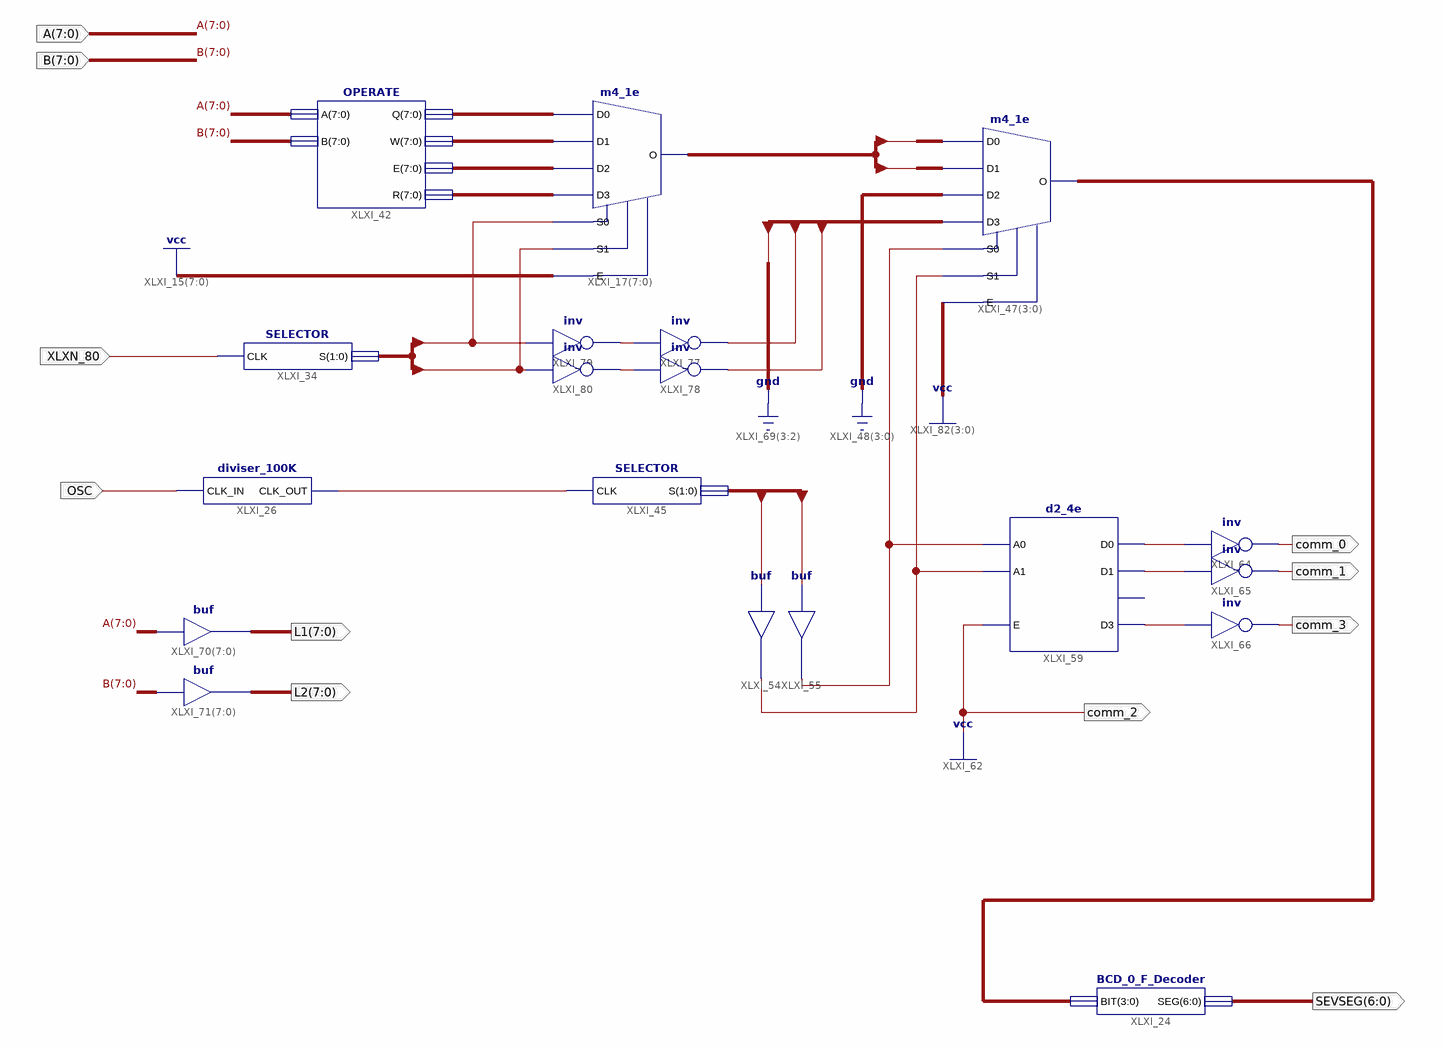
[diagram p0: schematic sheet 1]
// Xilinx ISE schematic ALU.sch (spartan6) as structural Verilog: 19 symbols, 11 ports
module ALU (
  input  XLXN_80,
  input  OSC,
  input  [7:0] A,
  input  [7:0] B,
  output [6:0] SEVSEG,
  output comm_2,
  output comm_0,
  output comm_1,
  output comm_3,
  output [7:0] L1,
  output [7:0] L2
);

  wire XLXN_222, XLXN_223, XLXN_227, XLXN_237, XLXN_238, XLXN_239, XLXN_260, XLXN_261;
  wire [1:0] \bit , C, S;
  wire [3:0] XLXN_26;
  wire [7:0] DATA, XLXN_12, XLXN_13, XLXN_14, XLXN_89;

  BCD_0_F_Decoder XLXI_24 (.BIT(XLXN_26), .SEG(SEVSEG));
  OPERATE XLXI_42 (.A(A), .B(B), .E(XLXN_89), .Q(XLXN_12), .R(XLXN_14), .W(XLXN_13));
  m4_1e XLXI_17[7:0] (
    .D0(XLXN_12), .D1(XLXN_13), .D2(XLXN_89), .D3(XLXN_14), .E({8{1'b1}}), .S0(S[0]), .S1(S[1]), .O(DATA));
  SELECTOR XLXI_34 (.CLK(XLXN_80), .S(S));
  SELECTOR XLXI_45 (.CLK(XLXN_227), .S(\bit ));
  m4_1e XLXI_47[3:0] (
    .D0(DATA[3:0]), .D1(DATA[7:4]), .D2(4'b0000), .D3({2'b00, C}), .E(4'b1111), .S0(XLXN_222), .S1(XLXN_223),
    .O(XLXN_26));
  buf XLXI_54 (XLXN_223, \bit [1]);
  buf XLXI_55 (XLXN_222, \bit [0]);
  diviser_100K XLXI_26 (.CLK_IN(OSC), .CLK_OUT(XLXN_227));
  d2_4e XLXI_59 (.A0(XLXN_222), .A1(XLXN_223), .E(1'b1), .D0(XLXN_237), .D1(XLXN_238), .D3(XLXN_239));  // open: D2
  not XLXI_64 (comm_0, XLXN_237);
  not XLXI_65 (comm_1, XLXN_238);
  not XLXI_66 (comm_3, XLXN_239);
  assign L1 = A;  // buf XLXI_70[7..0], 8 bits wide
  assign L2 = B;  // buf XLXI_71[7..0], 8 bits wide
  not XLXI_77 (C[0], XLXN_260);
  not XLXI_78 (C[1], XLXN_261);
  not XLXI_79 (XLXN_260, S[0]);
  not XLXI_80 (XLXN_261, S[1]);

  assign comm_2 = 1'b1;

  // Notes on the sheet:
  //   LOC on signal XLXN_80 = P47
  //   CLOCK_DEDICATED_ROUTE on signal XLXN_80 = true
  //   LOC on signal OSC = P123
  //   LOC on signal comm_2 = P33
  //   LOC on signal comm_0 = P44
  //   LOC on signal comm_1 = P43
  //   LOC on signal comm_3 = P30
endmodule
